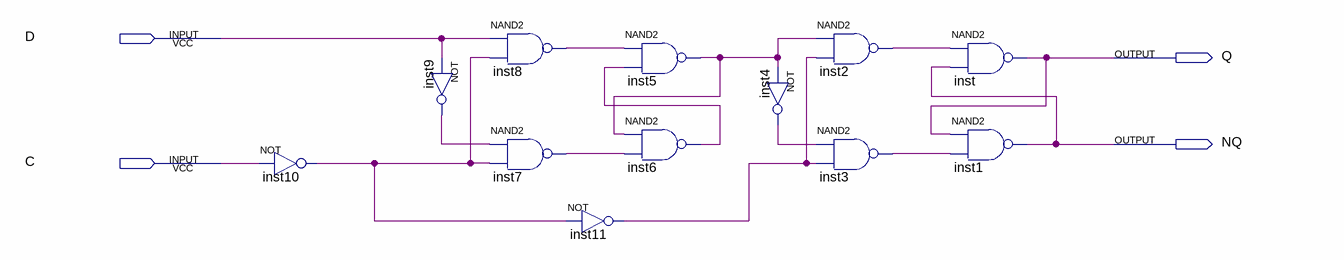
[diagram p0: schematic sheet]
// Quartus schematic DFF_Edge.bdf as structural Verilog: 12 symbols, 4 pins
module DFF_Edge (
  input  D,
  input  C,
  output Q,
  output NQ
);

  wire inst2_out, inst3_out, inst4_out, inst5_out, inst6_out, inst7_out, inst8_out, inst9_out, inst10_out,
       inst11_out;

  not inst10 (inst10_out, C);
  not inst9 (inst9_out, D);
  nand inst8 (inst8_out, D, inst10_out);
  nand inst7 (inst7_out, inst9_out, inst10_out);
  not inst11 (inst11_out, inst10_out);
  nand inst5 (inst5_out, inst8_out, inst6_out);
  nand inst6 (inst6_out, inst5_out, inst7_out);
  not inst4 (inst4_out, inst5_out);
  nand inst2 (inst2_out, inst5_out, inst11_out);
  nand inst3 (inst3_out, inst4_out, inst11_out);
  nand inst (Q, inst2_out, NQ);
  nand inst1 (NQ, Q, inst3_out);
endmodule
